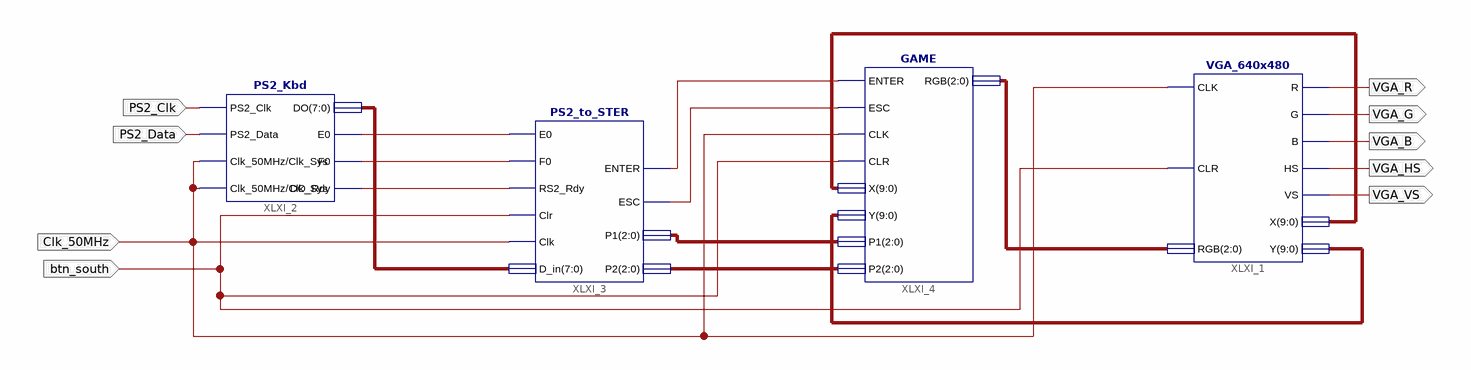
[diagram p0: schematic sheet 1]
// Xilinx ISE schematic main.sch (spartan3e) as structural Verilog: 4 symbols, 9 ports
module main (
  input  PS2_Clk,
  input  PS2_Data,
  input  Clk_50MHz,
  input  btn_south,
  output VGA_R,
  output VGA_G,
  output VGA_B,
  output VGA_HS,
  output VGA_VS
);

  wire XLXN_2, XLXN_3, XLXN_4, XLXN_10, XLXN_11;
  wire [2:0] XLXN_12, XLXN_13, XLXN_16;
  wire [7:0] XLXN_1;
  wire [9:0] XLXN_17, XLXN_18;

  VGA_640x480 XLXI_1 (
    .CLK(Clk_50MHz), .CLR(btn_south), .RGB(XLXN_16), .R(VGA_R), .G(VGA_G), .B(VGA_B), .HS(VGA_HS),
    .VS(VGA_VS), .X(XLXN_17), .Y(XLXN_18));
  PS2_Kbd XLXI_2 (
    .PS2_Clk(PS2_Clk), .PS2_Data(PS2_Data), .Clk_50MHz(Clk_50MHz), .E0(XLXN_2), .F0(XLXN_3), .DO_Rdy(XLXN_4),
    .DO(XLXN_1), .Clk_Sys(Clk_50MHz));
  PS2_to_STER XLXI_3 (
    .E0(XLXN_2), .F0(XLXN_3), .RS2_Rdy(XLXN_4), .Clr(btn_south), .Clk(Clk_50MHz), .D_in(XLXN_1),
    .ENTER(XLXN_10), .ESC(XLXN_11), .P1(XLXN_12), .P2(XLXN_13));
  GAME XLXI_4 (
    .ENTER(XLXN_10), .ESC(XLXN_11), .CLK(Clk_50MHz), .CLR(btn_south), .X(XLXN_17), .Y(XLXN_18), .P1(XLXN_12),
    .P2(XLXN_13), .RGB(XLXN_16));
endmodule
